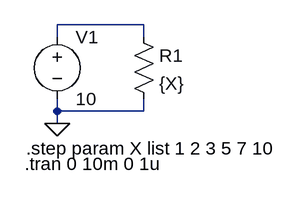
[diagram p0: schematic STEP.asc]
STEP.asc, the LTspice schematic file:
Version 4
SHEET 1 880 680
WIRE 64 48 -48 48
WIRE -48 64 -48 48
WIRE 64 64 64 48
WIRE -48 160 -48 144
WIRE 64 160 64 144
WIRE 64 160 -48 160
WIRE -48 176 -48 160
FLAG -48 176 0
SYMBOL res 48 48 R0
SYMATTR InstName R1
SYMATTR Value {X}
SYMBOL voltage -48 48 R0
WINDOW 123 0 0 Left 0
WINDOW 39 0 0 Left 0
SYMATTR InstName V1
SYMATTR Value 10
TEXT -88 208 Left 2 !.step param X list 1 2 3 5 7 10
TEXT -90 228 Left 2 !.tran 0 10m 0 1u

The netlist it stands for:
* STEP.asc
R1 N001 0 {X}
V1 N001 0 10
.step param X list 1 2 3 5 7 10
.tran 0 10m 0 1u
.backanno
.end